# Altium schematic sheet MiniAir724UG.SchDoc
size A3
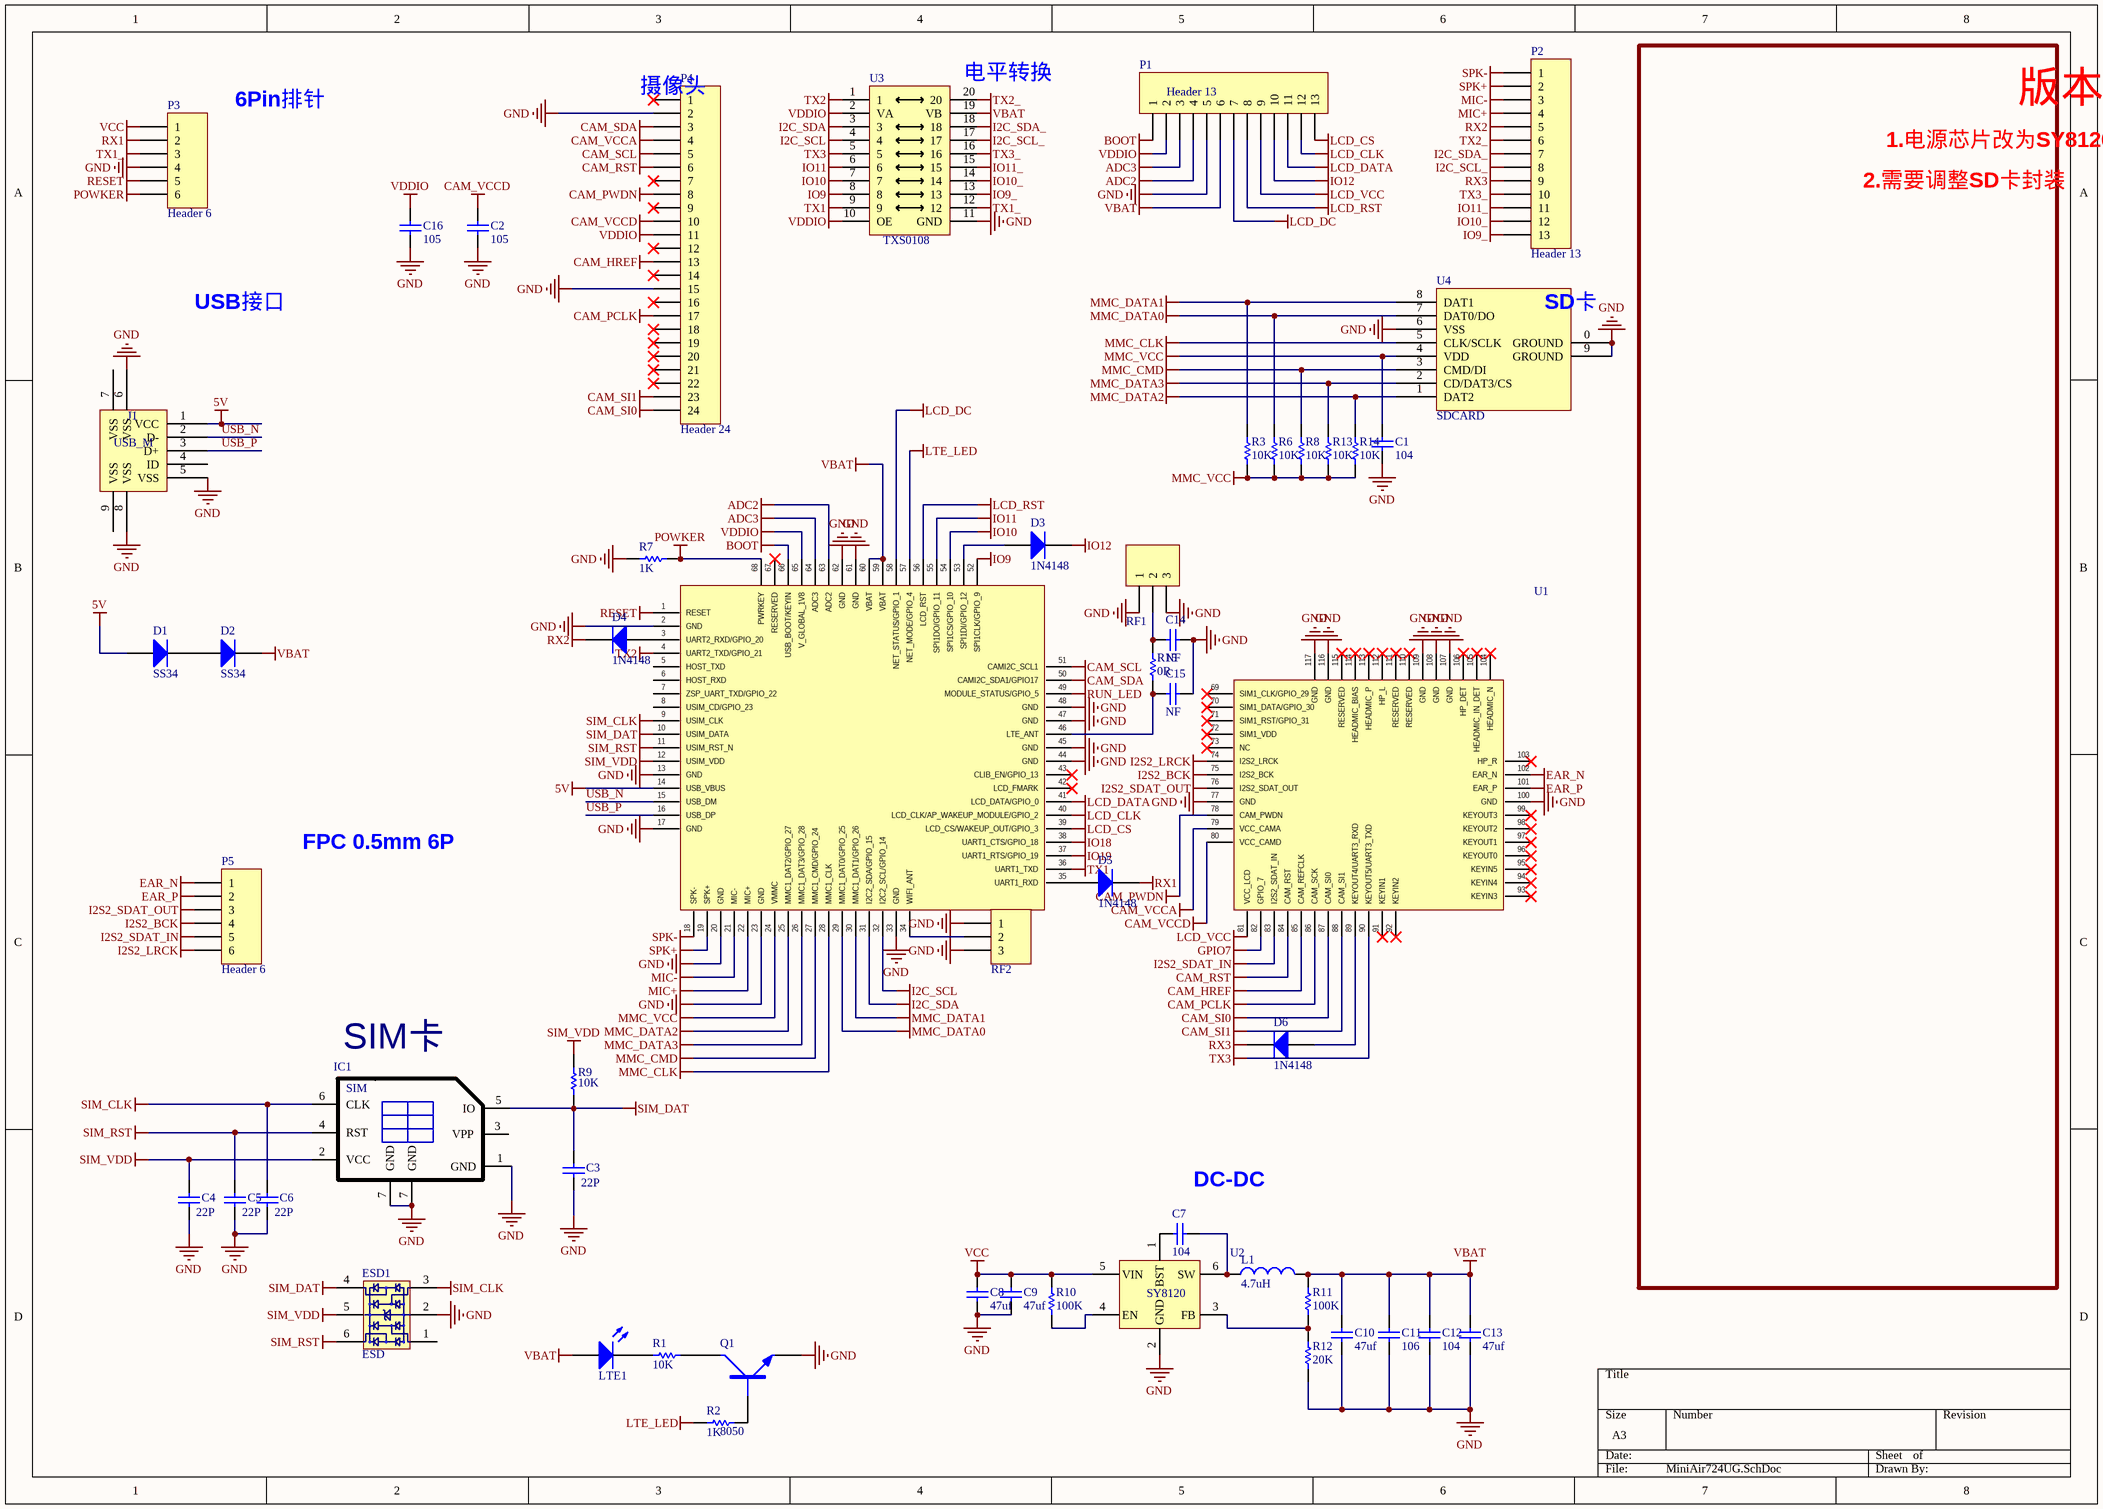
[diagram p0: MiniAir724UG.SchDoc]

## Parts
C1  104  [0402C]
C2  105  [0402C]
C3  22P  [0402C]
C4  22P  [0402C]
C5  22P  [0402C]
C6  22P  [0402C]
C7  104  [0603C]
C8  47uf  [1206C]
C9  47uf  [1206C]
C10  47uf  [1206C]
C11  106  [0603C]
C12  104  [0603C]
C13  47uf  [1206C]
C14  NF  [0603C]
C15  NF  [0603C]
C16  105  [0402C]
D1  SS34  [SMA]
D2  SS34  [SMA]
D3  1N4148  [SOD-523]
D4  1N4148  [SOD-523]
D5  1N4148  [SOD-523]
D6  1N4148  [SOD-523]
ESD1  ESD  [SOT-236]
IC1  SIM  [SIM-Nano]
J1  USB_M  [micro_usb_b]
L1  4.7uH  [SWPA4020S]
LTE1  LED  [0603LED]  (value not drawn)
P1  Header 13  [HDR1X13]
P2  Header 13  [HDR1X13]
P3  Header 6  [HDR1X6]
P4  Header 24  [FPC0.5 2H-WS-24P]
P5  Header 6  [FPC0.5 2H-WS-6P]
Q1  8050  [SOT-23]
R1  10K  [0402R]
R2  1K  [0402R]
R3  10K  [0402R]
R6  10K  [0402R]
R7  1K  [0402R]
R8  10K  [0402R]
R9  10K  [0402R]
R10  100K  [0603R]
R11  100K  [0603R]
R12  20K  [0603R]
R13  10K  [0402R]
R14  10K  [0402R]
R15  0R  [0603R]
RF1  Header 3  [IPEX]  (value not drawn)
RF2  Header 3  [IPEX]  (value not drawn)
U1  Air724  [AIR724UG]  (value not drawn)
U2  SY8120  [SOT-236]
U3  TXS0108  [SSOP20]
U4  SDCARD  [SDCARD-Mini]

## Nets
5V: D1.1(A) J1.1(VCC) U1.14(USB_VBUS)
ADC2: P1.4 U1.63(ADC2)
ADC3: P1.3 U1.64(ADC3)
BOOT: P1.1 U1.66(USB_BOOT/KEYIN)
CAM_HREF: P4.13 U1.85(CAM_REFCLK)
CAM_PCLK: P4.17 U1.86(CAM_SCK)
CAM_PWDN: P4.8 U1.78(CAM_PWDN)
CAM_RST: P4.6 U1.84(CAM_RST)
CAM_SCL: P4.5 U1.51(CAMI2C_SCL1)
CAM_SDA: P4.3 U1.50(CAMI2C_SDA1/GPIO17)
CAM_SI0: P4.24 U1.87(CAM_SI0)
CAM_SI1: P4.23 U1.88(CAM_SI1)
CAM_VCCA: P4.4 U1.79(VCC_CAMA)
CAM_VCCD: C2.2 P4.10 U1.80(VCC_CAMD)
EAR_N: P5.1 U1.102(EAR_N)
EAR_P: P5.2 U1.101(EAR_P)
GND: C1.1 C2.1 C3.2 C4.2 C5.2 C6.2 C8.1 C9.1 C10.1 C11.1 C12.1 C13.1 C14.1 C15.1 C16.1 ESD1.2 IC1.1(GND) IC1.7(GND) J1.5(VSS) J1.6(VSS) J1.8(VSS) P1.5 P3.4 P4.2 P4.15 Q1.2(E) R7.1 R12.1 RF1.1 RF1.3 RF2.1 RF2.3 U1.2(GND) U1.13(GND) U1.17(GND) U1.20(GND) U1.23(GND) U1.33(GND) U1.44(GND) U1.45(GND) U1.47(GND) U1.48(GND) U1.61(GND) U1.62(GND) U1.77(GND) U1.100(GND) U1.107(GND) U1.108(GND) U1.109(GND) U1.116(GND) U1.117(GND) U2.2(GND) U3.11(GND) U4.0(GROUND) U4.6(VSS) U4.9(GROUND)
GPIO7: U1.82(GPIO_7)
I2C_SCL: U1.32(I2C2_SCL/GPIO_14) U3.4
I2C_SCL_: P2.8 U3.17
I2C_SDA: U1.31(I2C2_SDA/GPIO_15) U3.3
I2C_SDA_: P2.7 U3.18
I2S2_BCK: P5.4 U1.75(I2S2_BCK)
I2S2_LRCK: P5.6 U1.74(I2S2_LRCK)
I2S2_SDAT_IN: P5.5 U1.83(I2S2_SDAT_IN)
I2S2_SDAT_OUT: P5.3 U1.76(I2S2_SDAT_OUT)
IO9: U1.52(SPI1CLK/GPIO_9) U3.8
IO9_: P2.13 U3.13
IO10: U1.54(SPI1CS/GPIO_10) U3.7
IO10_: P2.12 U3.14
IO11: U1.55(SPI1DO/GPIO_11) U3.6
IO11_: P2.11 U3.15
IO12: D3.2(K) P1.10
IO18: U1.38(UART1_CTS/GPIO_18)
IO19: U1.37(UART1_RTS/GPIO_19)
LCD_CLK: P1.12 U1.40(LCD_CLK/AP_WAKEUP_MODULE/GPIO_2)
LCD_CS: P1.13 U1.39(LCD_CS/WAKEUP_OUT/GPIO_3)
LCD_DATA: P1.11 U1.41(LCD_DATA/GPIO_0)
LCD_DC: P1.7 U1.58(NET_STATUS/GPIO_1)
LCD_RST: P1.8 U1.56(LCD_RST)
LCD_VCC: P1.9 U1.81(VCC_LCD)
LTE_LED: R2.2 U1.57(NET_MODE/GPIO_4)
MIC+: P2.4 U1.22(MIC+)
MIC-: P2.3 U1.21(MIC-)
MMC_CLK: U1.28(MMC1_CLK) U4.5(CLK/SCLK)
MMC_CMD: R8.1 U1.27(MMC1_CMD/GPIO_24) U4.3(CMD/DI)
MMC_DATA0: R6.1 U1.29(MMC1_DAT0/GPIO_25) U4.7(DAT0/DO)
MMC_DATA1: R3.1 U1.30(MMC1_DAT1/GPIO_26) U4.8(DAT1)
MMC_DATA2: R14.1 U1.25(MMC1_DAT2/GPIO_27) U4.1(DAT2)
MMC_DATA3: R13.1 U1.26(MMC1_DAT3/GPIO_28) U4.2(CD/DAT3/CS)
MMC_VCC: C1.2 R3.2 R6.2 R8.2 R13.2 R14.2 U1.24(VMMC) U4.4(VDD)
POWKER: P3.6 R7.2 U1.68(PWRKEY)
RESET: P3.5 U1.1(RESET)
RUN_LED: U1.49(MODULE_STATUS/GPIO_5)
RX1: D5.2(K) P3.2
RX2: D4.2(K) P2.5
RX3: D6.2(K) P2.9
SIM_CLK: C6.1 ESD1.3 IC1.6(CLK) U1.9(USIM_CLK)
SIM_DAT: C3.1 ESD1.4 IC1.5(IO) R9.2 U1.10(USIM_DATA)
SIM_RST: C5.1 ESD1.6 IC1.4(RST) U1.11(USIM_RST_N)
SIM_VDD: C4.1 ESD1.5 IC1.2(VCC) R9.1 U1.12(USIM_VDD)
SPK+: P2.2 U1.19(SPK+)
SPK-: P2.1 U1.18(SPK-)
TX1: U1.36(UART1_TXD) U3.9
TX1_: P3.3 U3.12
TX2: U1.4(UART2_TXD/GPIO_21) U3.1
TX2_: P2.6 U3.20
TX3: U1.90(KEYOUT5/UART3_TXD) U3.5
TX3_: P2.10 U3.16
VBAT: C10.2 C11.2 C12.2 C13.2 D2.2(K) L1.2 LTE1.1(A) P1.6 R11.2 U1.59(VBAT) U1.60(VBAT) U3.19(VB)
VCC: C8.2 C9.2 P3.1 R10.1 U2.5(VIN)
VDDIO: C16.2 P1.2 P4.11 U1.65(V_GLOBAL_1V8) U3.2(VA) U3.10(OE)
USB_N: J1.2(D-) U1.15(USB_DM)
USB_P: J1.3(D+) U1.16(USB_DP)
NetC7_1: C7.1 U2.1(BST)
NetC7_2: C7.2 L1.1 U2.6(SW)
NetC14_2: C14.2 R15.2 RF1.2
NetC15_2: C15.2 R15.1 U1.46(LTE_ANT)
NetD1_2: D1.2(K) D2.1(A)
NetD3_1: D3.1(A) U1.53(SPI1DI/GPIO_12)
NetD4_1: D4.1(A) U1.3(UART2_RXD/GPIO_20)
NetD5_1: D5.1(A) U1.35(UART1_RXD)
NetD6_1: D6.1(A) U1.89(KEYOUT4/UART3_RXD)
NetLTE1_2: LTE1.2(K) R1.2
NetQ1_1: Q1.1(B) R2.1
NetQ1_3: Q1.3(C) R1.1
NetR10_2: R10.2 U2.4(EN)
NetR11_1: R11.1 R12.2 U2.3(FB)
NetRF2_2: RF2.2 U1.34(WIFI_ANT)

Not connected (* = marked no-connect by the designer): ESD1 1; IC1 3(VPP); J1 4(ID) 7(VSS) 9(VSS); P4 1* 7* 9* 12* 14* 16* 18* 19* 20* 21* 22*; U1 5(HOST_TXD) 6(HOST_RXD) 7(ZSP_UART_TXD/GPIO_22) 8(USIM_CD/GPIO_23) 42(LCD_FMARK)* 43(CLIB_EN/GPIO_13)* 67(RESERVED)* 69(SIM1_CLK/GPIO_29)* 70(SIM1_DATA/GPIO_30)* 71(SIM1_RST/GPIO_31)* 72(SIM1_VDD)* 73(NC)* 91(KEYIN1)* 92(KEYIN2)* 93(KEYIN3)* 94(KEYIN4)* 95(KEYIN5)* 96(KEYOUT0)* 97(KEYOUT1)* 98(KEYOUT2)* 99(KEYOUT3)* 103(HP_R)* 104(HEADMIC_N)* 105(HEADMIC_IN_DET)* 106(HP_DET)* 110(RESERVED)* 111(RESERVED)* 112(HP_L)* 113(HEADMIC_P)* 114(HEADMIC_BIAS)* 115(RESERVED)*

## Notes on the sheet
- (near P3) 6Pin排针
- (near P4) 摄像头
- (near U3) 电平转换
- 版本:V1.0(预售版)
- 1.电源芯片改为SY8120
- 2.需要调整SD卡封装
- USB接口
- (near U4) SD卡
- (near P5) FPC 0.5mm 6P
- (near IC1) SIM卡
- (near C7) DC-DC

## Library data of the parts
C1-C16 = Cap: Capacitor; Published: 8-Jun-2000; LatestRevisionDate: 17-Jul-2002; LatestRevisionNote: Re-released for DXP Platform.; PackageReference: RAD-0.3; Publisher: Altium Limited; PackageDescription: Radial Cap, Thru-Hole; 2 Leads; 0.3 in Pin Spacing
D1 D2 = Diode: 二极管; Published: 8-Jun-2000; LatestRevisionDate: 17-Jul-2002; LatestRevisionNote: Re-released for DXP Platform.; PackageReference: SMC; Publisher: Altium Limited; PackageDescription: DO-214-AB/SMC; 2 C-Bend Leads; Body 7.9 x 5.9 mm, inc. leads (LxW); PackageVersion: Sep-1996; Code_JEDEC: DO-214-AB
D3-D6 = Diode: 快速二极管; Published: 8-Jun-2000; LatestRevisionDate: 17-Jul-2002; LatestRevisionNote: Re-released for DXP Platform.; PackageReference: SMC; Publisher: Altium Limited; PackageDescription: DO-214-AB/SMC; 2 C-Bend Leads; Body 7.9 x 5.9 mm, inc. leads (LxW); PackageVersion: Sep-1996; Code_JEDEC: DO-214-AB
ESD1 = ESD_4A
J1 = USB_M: MicroUSB接口
L1 = Inductor: 电感SLF7032; Code_IEC: 1005; Published: 8-Jun-2000; LatestRevisionDate: 29-May-2009; LatestRevisionNote: IPC-7351 Footprint Added.; PackageReference: 0402-A; Publisher: Altium Limited; PackageDescription: Chip Inductor; Code_JEITA: 0402
LTE1 = LED2: Typical RED, GREEN, YELLOW, AMBER GaAs LED; Published: 8-Jun-2000; LatestRevisionDate: 17-Jul-2002; LatestRevisionNote: Re-released for DXP Platform.; PackageVersion: Feb-2002; PackageReference: 3.2X1.6X1.1; Publisher: Altium Limited; PackageDescription: SM LED; 2 Flat Leads
P1 P2 = Header 13: Header, 13-Pin; LatestRevisionDate: 17-Jul-2002; LatestRevisionNote: Re-released for DXP Platform.; Publisher: Altium Limited
P3 P5 = Header 6: Header, 6-Pin; LatestRevisionDate: 17-Jul-2002; LatestRevisionNote: Re-released for DXP Platform.; Publisher: Altium Limited
P4 = Header 24: Header, 24-Pin; LatestRevisionDate: 17-Jul-2002; LatestRevisionNote: Re-released for DXP Platform.; Publisher: Altium Limited
Q1 = NPN
R1-R3 R6-R15 = Res1: Resistor; Published: 8-Jun-2000; LatestRevisionDate: 17-Jul-2002; LatestRevisionNote: Re-released for DXP Platform.; PackageReference: AXIAL-0.3; Publisher: Altium Limited; PackageDescription: Axial Device, Thru-Hole; 2 Leads; 0.3 in Pin Spacing
RF1 RF2 = Header 3: 接插件; LatestRevisionDate: 17-Jul-2002; LatestRevisionNote: Re-released for DXP Platform.; Publisher: Altium Limited
U1 = Air724UG: Published: 8-Jun-2000; LatestRevisionDate: 17-Jul-2002; LatestRevisionNote: Re-released for DXP Platform.; PackageReference: AXIAL-0.4; Publisher: Altium Limited
U2 = JW5026
U4 = SDCARD-Mini